# EAGLE schematic PCB-RS422-DB9-BO (EAGLE 7.1.0)

## Sheet 1 of 2
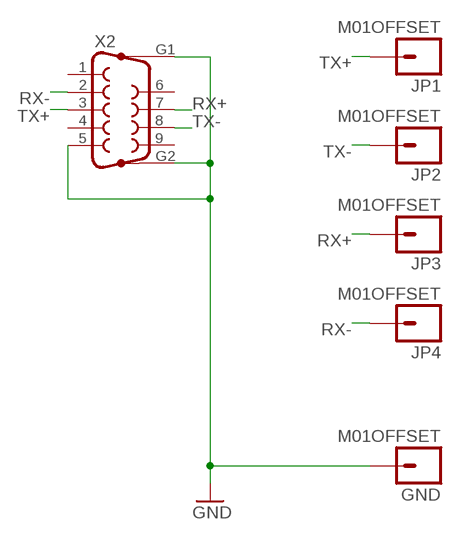
[diagram p0: schematic, sheet 1]

### Parts
GND  M01OFFSET  [1X01_OFFSET]
JP1  M01OFFSET  [1X01_OFFSET]
JP2  M01OFFSET  [1X01_OFFSET]
JP3  M01OFFSET  [1X01_OFFSET]
JP4  M01OFFSET  [1X01_OFFSET]
X2  F09HP  [F09HP]

### Nets
GND [Power]: GND.1 X2.5 X2.G1 X2.G2
RX+: JP3.1 X2.7
RX-: JP4.1 X2.2
TX+: JP1.1 X2.3
TX-: JP2.1 X2.8
Unconnected: X2.1 X2.4 X2.6 X2.9

## Sheet 2 of 2

## Library data of the parts
GND JP1-JP4 = SparkFun:M01: Header 1 Standard 1-pin 0.1" header. Use with straight break away headers (SKU : PRT-00116), right angle break away headers (PRT-00553), swiss pins (PRT-00743), machine pins (PRT-00117), and female headers (PRT-00115).
X2 = con-subd:F09HP: SUB-D; OC_FARNELL: unknown; OC_NEWARK: unknown

## Net classes
0 default: width 0.203 mm, drill 0.406 mm, clearance 0.203 mm
1 Power: width 0.406 mm, drill 0.61 mm, clearance 0.203 mm
2 RELAY LINES: width 0.305 mm, drill 0.406 mm, clearance 0.254 mm
3 INput lines: width 0.203 mm, drill 0.406 mm, clearance 0.254 mm